# Altium project slam.PrjPCB
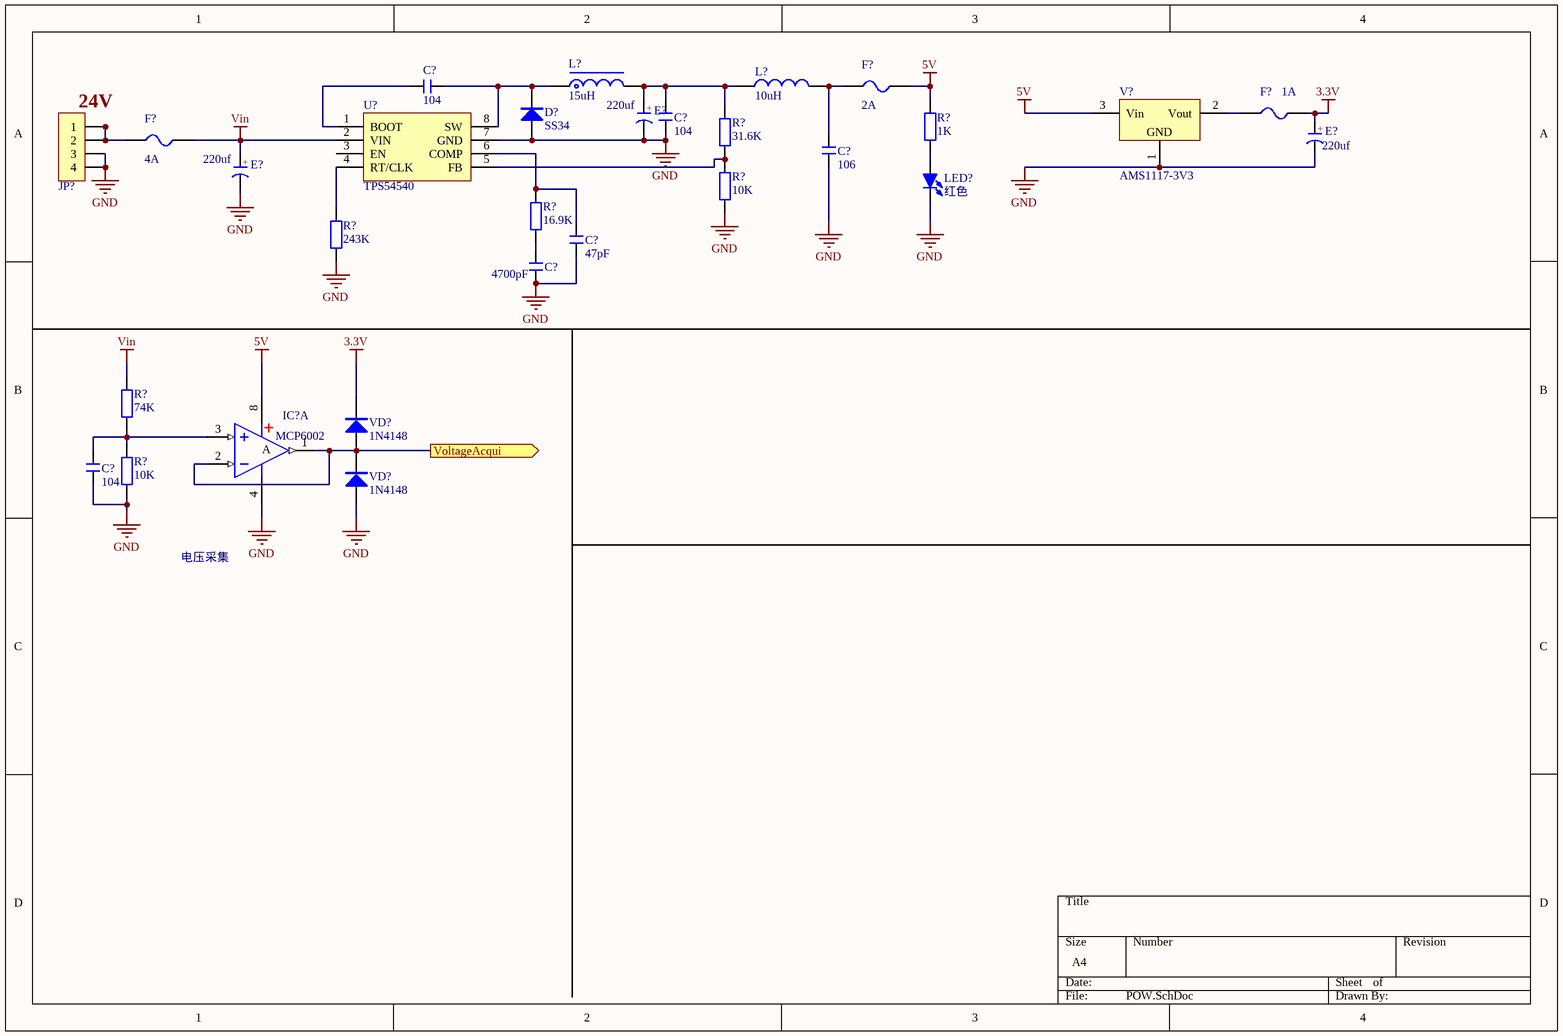
[diagram p0: POW.SchDoc]
2 sheets, 58 parts. Net scope: flat (ports and power ports of the same name join across sheets).
Board file: MAIN.PcbDoc
Sheets:
  POW.SchDoc
  MOTO.SchDoc

## Sheet POW.SchDoc
size A4

### Parts
(Parts that share a designator on the sheet are numbered #1, #2 ... from top to bottom, then left to right.)
C?#1  104  [C 0603_L]
C?#2  104  [C 0603_L]
C?#3  106  [C 0603_L]
C?#4  47pF  [C 0603_L]
C?#5  4700pF  [C 0603_L]
C?#6  104  [C 0603]
D?  SS34  [SMC]
E?#1  220uf  [CM E(8*10.2)]
E?#2  220uf  [CM E(8*10.2)]
E?#3  220uf  [CM E(8*10.2)]
F?#1  2A  [FU 1206]
F?#2  1A  [FU 0805]
F?#3  4A  [FU 1206]
IC?#1  MCP6002  [SOP8_N]  (part A of 2)
JP?#1  HDR-1X4  [XH2.54-LI-4P]  (value not drawn)
L?#1  15uH  [CDRH73]
L?#2  10uH  [L 0805]
LED?  红色  [LED 0603R]
R?#1  1K  [R 0603_L]
R?#2  31.6K  [R 0603_L]
R?#3  10K  [R 0603_L]
R?#4  16.9K  [R 0603_L]
R?#5  243K  [R 0603_L]
R?#6  74K  [R 0603_L]
R?#7  10K  [R 0603_L]
U?#1  TPS54540  [SOP8_1]
V?  AMS1117-3V3  [SOT223_M]
VD?#1  1N4148  [SOD-323]
VD?#2  1N4148  [SOD-323]

### Ports
VoltageAcqui (out)

### Nets
3.3V: E?#2.1(A) F?#2.2 VD?#1.2(K)
5V: F?#1.2 IC?#1.8(V+) R?#1.2 V?.3(Vin)
GND: C?#2.1 C?#3.1 C?#4.1 C?#5.1 C?#6.1 D?.1(A) E?#1.2(K) E?#2.2(K) E?#3.2(K) IC?#1.4(V-) JP?#1.3 JP?#1.4 LED?.2(K) R?#3.1 R?#5.1 R?#7.1 U?#1.7(GND) V?.1(GND) VD?#2.1(A)
Vin: E?#3.1(A) F?#3.2 R?#6.2 U?#1.2(VIN)
NetC?#1_1: C?#1.1 U?#1.1(BOOT)
NetC?#1_2: C?#1.2 D?.2(K) L?#1.1 U?#1.8(SW)
NetC?#2_2: C?#2.2 E?#1.1(A) L?#1.2 L?#2.1 R?#2.2
NetC?#3_2: C?#3.2 F?#1.1 L?#2.2
NetC?#4_2: C?#4.2 R?#4.2 U?#1.6(COMP)
NetC?#5_2: C?#5.2 R?#4.1
NetC?#6_2: C?#6.2 IC?#1.3(IN+) R?#6.1 R?#7.2
NetF?#2_1: F?#2.1 V?.2(Vout)
NetF?#3_1: F?#3.1 JP?#1.1 JP?#1.2
NetIC?#1_1: IC?#1.1(OUT) IC?#1.2(IN-) VD?#1.1(A) VD?#2.2(K) ; port VoltageAcqui
NetLED?_1: LED?.1(A) R?#1.1
NetR?#2_1: R?#2.1 R?#3.2 U?#1.5(FB)
NetR?#5_2: R?#5.2 U?#1.4(RT/CLK)

Not connected (* = marked no-connect by the designer): U?#1 3(EN)

### Notes on the sheet
- (near JP?#1) 24V
- 电压采集
- (in symbol C-CM) +
- (in symbol LM358, part A) A

### Library data of the parts
C?#1-C?#6 = C: 无极性贴片电容; 版权归属: 源创客; BOM名称: 无极性贴片电容; 学习资源: www.ooocke.com
D? = SS34: 肖特基二极管; 版权归属: 源创客; 属性: 40V/3A; BOM名称: 肖特基二极管; 学习资源: www.ooocke.com
E?#1-E?#3 = C-CM: 贴片电解电容; 版权归属: 源创客; BOM名称: 贴片电解电容; 学习资源: www.ooocke.com
F?#1-F?#3 = FU: 贴片保险丝; 版权归属: 源创客; BOM名称: 贴片保险丝; 学习资源: www.ooocke.com
IC?#1 = LM358: 双路运放; 版权归属: 源创客; BOM名称: 双路运放; 学习资源: www.ooocke.com
JP?#1 = Header 4: 4P接插件; 版权归属: 源创客; BOM名称: 4P接插件; 学习资源: www.ooocke.com
L?#1 = L-CDRH: 功率屏蔽电感; 版权归属: 源创客; BOM名称: 功率屏蔽电感; 学习资源: www.ooocke.com
L?#2 = L: 小功率贴片电感; 版权归属: 源创客; BOM名称: 小功率贴片电感; 学习资源: www.ooocke.com
LED? = LED-SMD: 贴片LED; 版权归属: 源创客; BOM名称: 贴片LED; 学习资源: www.ooocke.com
R?#1-R?#7 = R: 贴片电阻; 版权归属: 源创客; BOM名称: 贴片电阻; 学习资源: www.ooocke.com
V? = AMS1117: 三端稳压芯片; BOM名称: 稳压芯片; 版权归属: 源创客; 学习资源: www.ooocke.com
VD?#1 VD?#2 = 1N4148: 高速开关二极管; 版权归属: 源创客; BOM名称: 高速开关二极管; 学习资源: www.ooocke.com

## Sheet MOTO.SchDoc
size A3
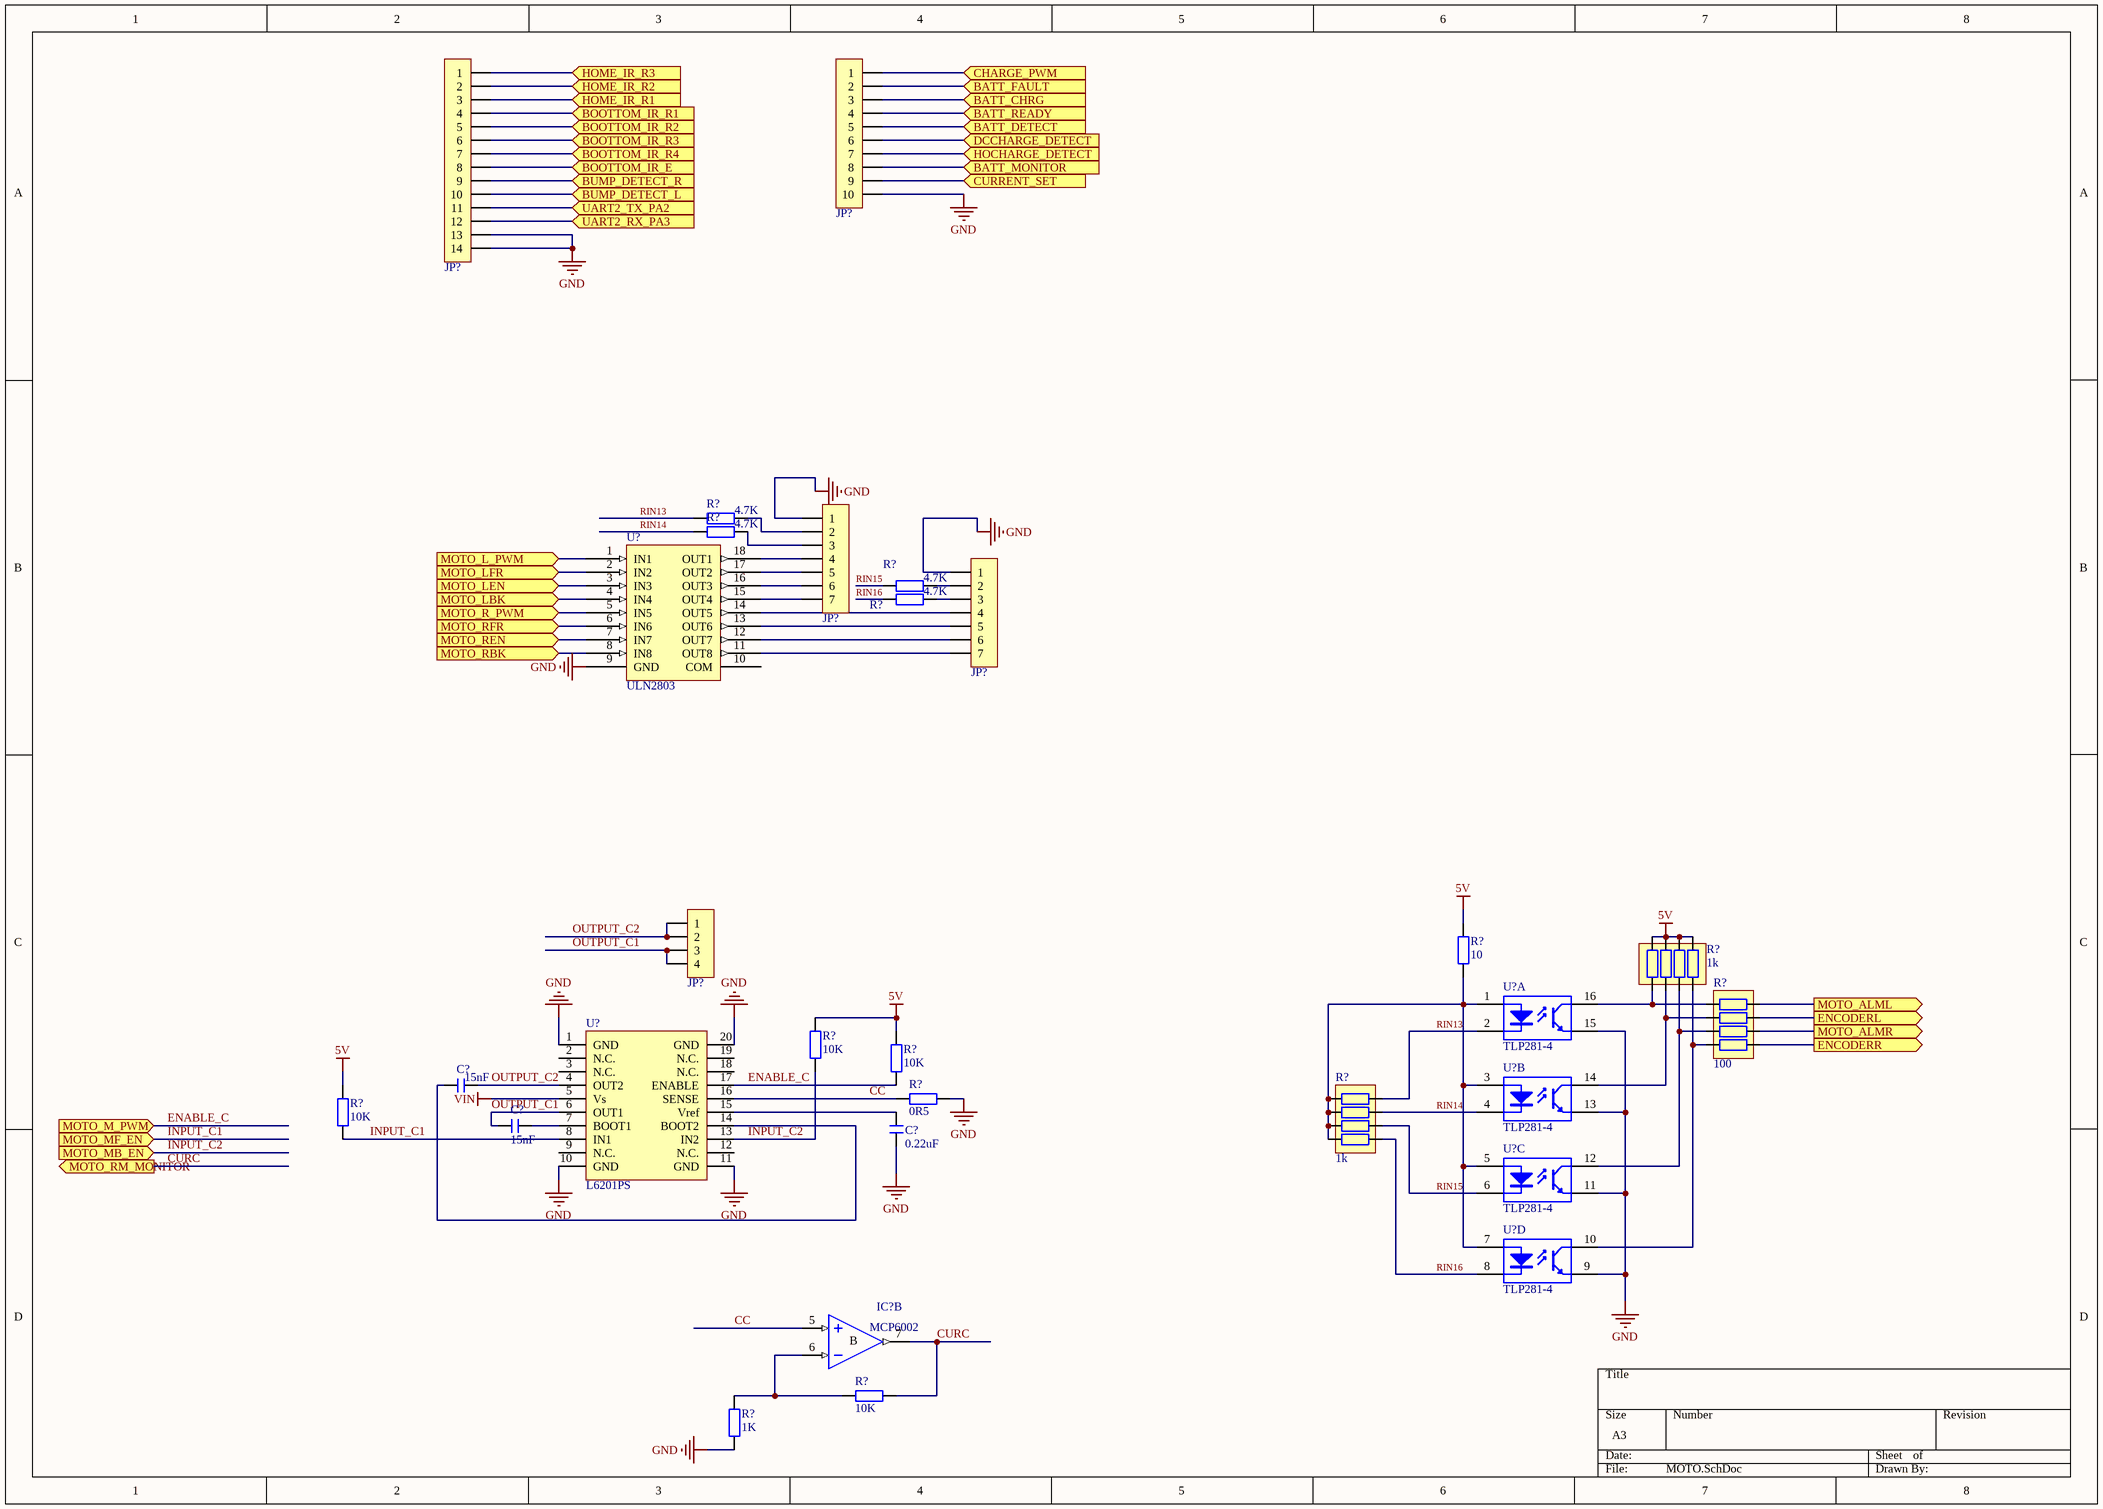
[diagram p1: MOTO.SchDoc]

### Parts
(Parts that share a designator on the sheet are numbered #1, #2 ... from top to bottom, then left to right.)
C?#7  15nF  [C 0603_L]
C?#8  15nF  [C 0603_L]
C?#9  0.22uF  [C 0603_L]
IC?#2  MCP6002  [SOP8_N]  (part B of 2)
JP?#2  HDR-1X14  [HDR-1X14]  (value not drawn)
JP?#3  HDR-1X10  [HDR-1X10]  (value not drawn)
JP?#4  HDR-1X7  [XH2.54-WI-7P]  (value not drawn)
JP?#5  HDR-1X7  [XH2.54-WI-7P]  (value not drawn)
JP?#6  HDR-1X4  [XH2.54-WI-4P]  (value not drawn)
R?#8  4.7K  [R 0603_L]
R?#9  4.7K  [R 0603_L]
R?#10  4.7K  [R 0603_L]
R?#11  4.7K  [R 0603_L]
R?#12  10  [R 0603_L]
R?#13  1k  [RCA-8P4R-0603]
R?#14  100  [RCA-8P4R-0603]
R?#15  10K  [R 0603_L]
R?#16  10K  [R 0603_L]
R?#17  0R5  [RS 3W-V7]
R?#18  1k  [RCA-8P4R-0603]
R?#19  10K  [R 0603_L]
R?#20  10K  [R 0603_L]
R?#21  1K  [R 0603_L]
U?#2  ULN2803  [SO-G18]
U?#3  TLP281-4  [SOP16N_N]  (part A of 4)
U?#4  L6201PS  [SO_PowerSO20]
U?#5  TLP281-4  [SOP16N_n]  (part B of 4)
U?#6  TLP281-4  [SOP16N_n]  (part C of 4)
U?#7  TLP281-4  [SOP16N_n]  (part D of 4)

### Ports
BATT_CHRG (in), BATT_DETECT (in), BATT_FAULT (in), BATT_MONITOR (in), BATT_READY (in), BOOTTOM_IR_E (in), BOOTTOM_IR_R1 (in), BOOTTOM_IR_R2 (in), BOOTTOM_IR_R3 (in), BOOTTOM_IR_R4 (in), BUMP_DETECT_L (in), BUMP_DETECT_R (in), CHARGE_PWM (in), CURRENT_SET (in), DCCHARGE_DETECT (in), ENCODERL (out), ENCODERR (out), HOCHARGE_DETECT (in), HOME_IR_R1 (in), HOME_IR_R2 (in), HOME_IR_R3 (in), MOTO_ALML (out), MOTO_ALMR (out), MOTO_L_PWM (in), MOTO_LBK (in), MOTO_LEN (in), MOTO_LFR (in), MOTO_M_PWM (in), MOTO_MB_EN (in), MOTO_MF_EN (in), MOTO_R_PWM (in), MOTO_RBK (in), MOTO_REN (in), MOTO_RFR (in), MOTO_RM_MONITOR (out), UART2_RX_PA3 (in), UART2_TX_PA2 (in)

### Nets
5V: R?#12.1 R?#13.5 R?#13.6 R?#13.7 R?#13.8 R?#15.2 R?#16.2 R?#19.2
GND: C?#9.1 JP?#2.13 JP?#2.14 JP?#3.10 JP?#4.1 JP?#5.1 R?#17.2 R?#21.1 U?#2.9(GND) U?#3.15 U?#4.1(GND) U?#4.10(GND) U?#4.11(GND) U?#4.20(GND) U?#5.13 U?#6.11 U?#7.9
Vin: U?#4.5(Vs)
CC: IC?#2.5(IN+) R?#17.1 U?#4.16(SENSE)
CURC: IC?#2.7(OUT) R?#20.2 ; port MOTO_RM_MONITOR
ENABLE_C: R?#16.1 U?#4.17(ENABLE) ; port MOTO_M_PWM
INPUT_C1: R?#19.1 U?#4.8(IN1) ; port MOTO_MF_EN
INPUT_C2: R?#15.1 U?#4.13(IN2) ; port MOTO_MB_EN
OUTPUT_C1: C?#8.1 JP?#6.3 JP?#6.4 U?#4.6(OUT1)
OUTPUT_C2: C?#7.2 JP?#6.1 JP?#6.2 U?#4.4(OUT2)
RIN13: R?#8.2 R?#18.8 U?#3.2
RIN14: R?#9.2 R?#18.7 U?#5.4
RIN15: R?#10.2 R?#18.6 U?#6.6
RIN16: R?#11.2 R?#18.5 U?#7.8
NetC?#7_1: C?#7.1 U?#4.14(BOOT2)
NetC?#8_2: C?#8.2 U?#4.7(BOOT1)
NetC?#9_2: C?#9.2 U?#4.15(Vref)
NetIC?#2_6: IC?#2.6(IN-) R?#20.1 R?#21.2
NetJP?#2_1: JP?#2.1 ; port HOME_IR_R3
NetJP?#2_2: JP?#2.2 ; port HOME_IR_R2
NetJP?#2_3: JP?#2.3 ; port HOME_IR_R1
NetJP?#2_4: JP?#2.4 ; port BOOTTOM_IR_R1
NetJP?#2_5: JP?#2.5 ; port BOOTTOM_IR_R2
NetJP?#2_6: JP?#2.6 ; port BOOTTOM_IR_R3
NetJP?#2_7: JP?#2.7 ; port BOOTTOM_IR_R4
NetJP?#2_8: JP?#2.8 ; port BOOTTOM_IR_E
NetJP?#2_9: JP?#2.9 ; port BUMP_DETECT_R
NetJP?#2_10: JP?#2.10 ; port BUMP_DETECT_L
NetJP?#2_11: JP?#2.11 ; port UART2_TX_PA2
NetJP?#2_12: JP?#2.12 ; port UART2_RX_PA3
NetJP?#3_1: JP?#3.1 ; port CHARGE_PWM
NetJP?#3_2: JP?#3.2 ; port BATT_FAULT
NetJP?#3_3: JP?#3.3 ; port BATT_CHRG
NetJP?#3_4: JP?#3.4 ; port BATT_READY
NetJP?#3_5: JP?#3.5 ; port BATT_DETECT
NetJP?#3_6: JP?#3.6 ; port DCCHARGE_DETECT
NetJP?#3_7: JP?#3.7 ; port HOCHARGE_DETECT
NetJP?#3_8: JP?#3.8 ; port BATT_MONITOR
NetJP?#3_9: JP?#3.9 ; port CURRENT_SET
NetJP?#4_2: JP?#4.2 R?#8.1
NetJP?#4_3: JP?#4.3 R?#9.1
NetJP?#4_4: JP?#4.4 U?#2.18(OUT1)
NetJP?#4_5: JP?#4.5 U?#2.17(OUT2)
NetJP?#4_6: JP?#4.6 U?#2.16(OUT3)
NetJP?#4_7: JP?#4.7 U?#2.15(OUT4)
NetJP?#5_2: JP?#5.2 R?#10.1
NetJP?#5_3: JP?#5.3 R?#11.1
NetJP?#5_4: JP?#5.4 U?#2.14(OUT5)
NetJP?#5_5: JP?#5.5 U?#2.13(OUT6)
NetJP?#5_6: JP?#5.6 U?#2.12(OUT7)
NetJP?#5_7: JP?#5.7 U?#2.11(OUT8)
NetR?#12_2: R?#12.2 R?#18.1 R?#18.2 R?#18.3 R?#18.4 U?#3.1 U?#5.3 U?#6.5 U?#7.7
NetR?#13_1: R?#13.1 R?#14.8 U?#3.16
NetR?#13_2: R?#13.2 R?#14.7 U?#5.14
NetR?#13_3: R?#13.3 R?#14.6 U?#6.12
NetR?#13_4: R?#13.4 R?#14.5 U?#7.10
NetR?#14_1: R?#14.1 ; port MOTO_ALML
NetR?#14_2: R?#14.2 ; port ENCODERL
NetR?#14_3: R?#14.3 ; port MOTO_ALMR
NetR?#14_4: R?#14.4 ; port ENCODERR
NetU?#2_1: U?#2.1(IN1) ; port MOTO_L_PWM
NetU?#2_2: U?#2.2(IN2) ; port MOTO_LFR
NetU?#2_3: U?#2.3(IN3) ; port MOTO_LEN
NetU?#2_4: U?#2.4(IN4) ; port MOTO_LBK
NetU?#2_5: U?#2.5(IN5) ; port MOTO_R_PWM
NetU?#2_6: U?#2.6(IN6) ; port MOTO_RFR
NetU?#2_7: U?#2.7(IN7) ; port MOTO_REN
NetU?#2_8: U?#2.8(IN8) ; port MOTO_RBK

Not connected (* = marked no-connect by the designer): U?#2 10(COM); U?#4 2(N.C.) 3(N.C.) 9(N.C.) 12(N.C.) 18(N.C.) 19(N.C.)

### Notes on the sheet
- (in symbol LM358, part B) B

### Library data of the parts
C?#7-C?#9 = C: 无极性贴片电容; 版权归属: 源创客; BOM名称: 无极性贴片电容; 学习资源: www.ooocke.com
IC?#2 = LM358: 双路运放; 版权归属: 源创客; BOM名称: 双路运放; 学习资源: www.ooocke.com
JP?#2 = Header 14: 14P接插件; 版权归属: 源创客; BOM名称: 14P接插件; 学习资源: www.ooocke.com
JP?#3 = Header 10: 10P接插件; 版权归属: 源创客; BOM名称: 10P接插件; 学习资源: www.ooocke.com
JP?#4 JP?#5 = Header 7: 7P接插件; 版权归属: 源创客; BOM名称: 7P接插件; 学习资源: www.ooocke.com
JP?#6 = Header 4: 4P接插件; 版权归属: 源创客; BOM名称: 4P接插件; 学习资源: www.ooocke.com
R?#8-R?#12 R?#15 R?#16 R?#19-R?#21 = R: 贴片电阻; 版权归属: 源创客; BOM名称: 贴片电阻; 学习资源: www.ooocke.com
R?#13 R?#14 R?#18 = R-8P4R: 贴片网络排阻; 版权归属: 源创客; BOM名称: 贴片网络排阻; 学习资源: www.ooocke.com
R?#17 = R-CRR: 直插色环电阻; BOM名称: 色环电阻; 版权归属: 源创客; 学习资源: www.ooocke.com
U?#4 = L6201PS: 电机驱动H桥

## Nets that join several sheets
5V: POW (F?#1.2 IC?#1.8 R?#1.2 V?.3), MOTO (8 pins)
GND: POW (19 pins), MOTO (17 pins)
Vin: POW (E?#3.1 F?#3.2 R?#6.2 U?#1.2), MOTO (U?#4.5)